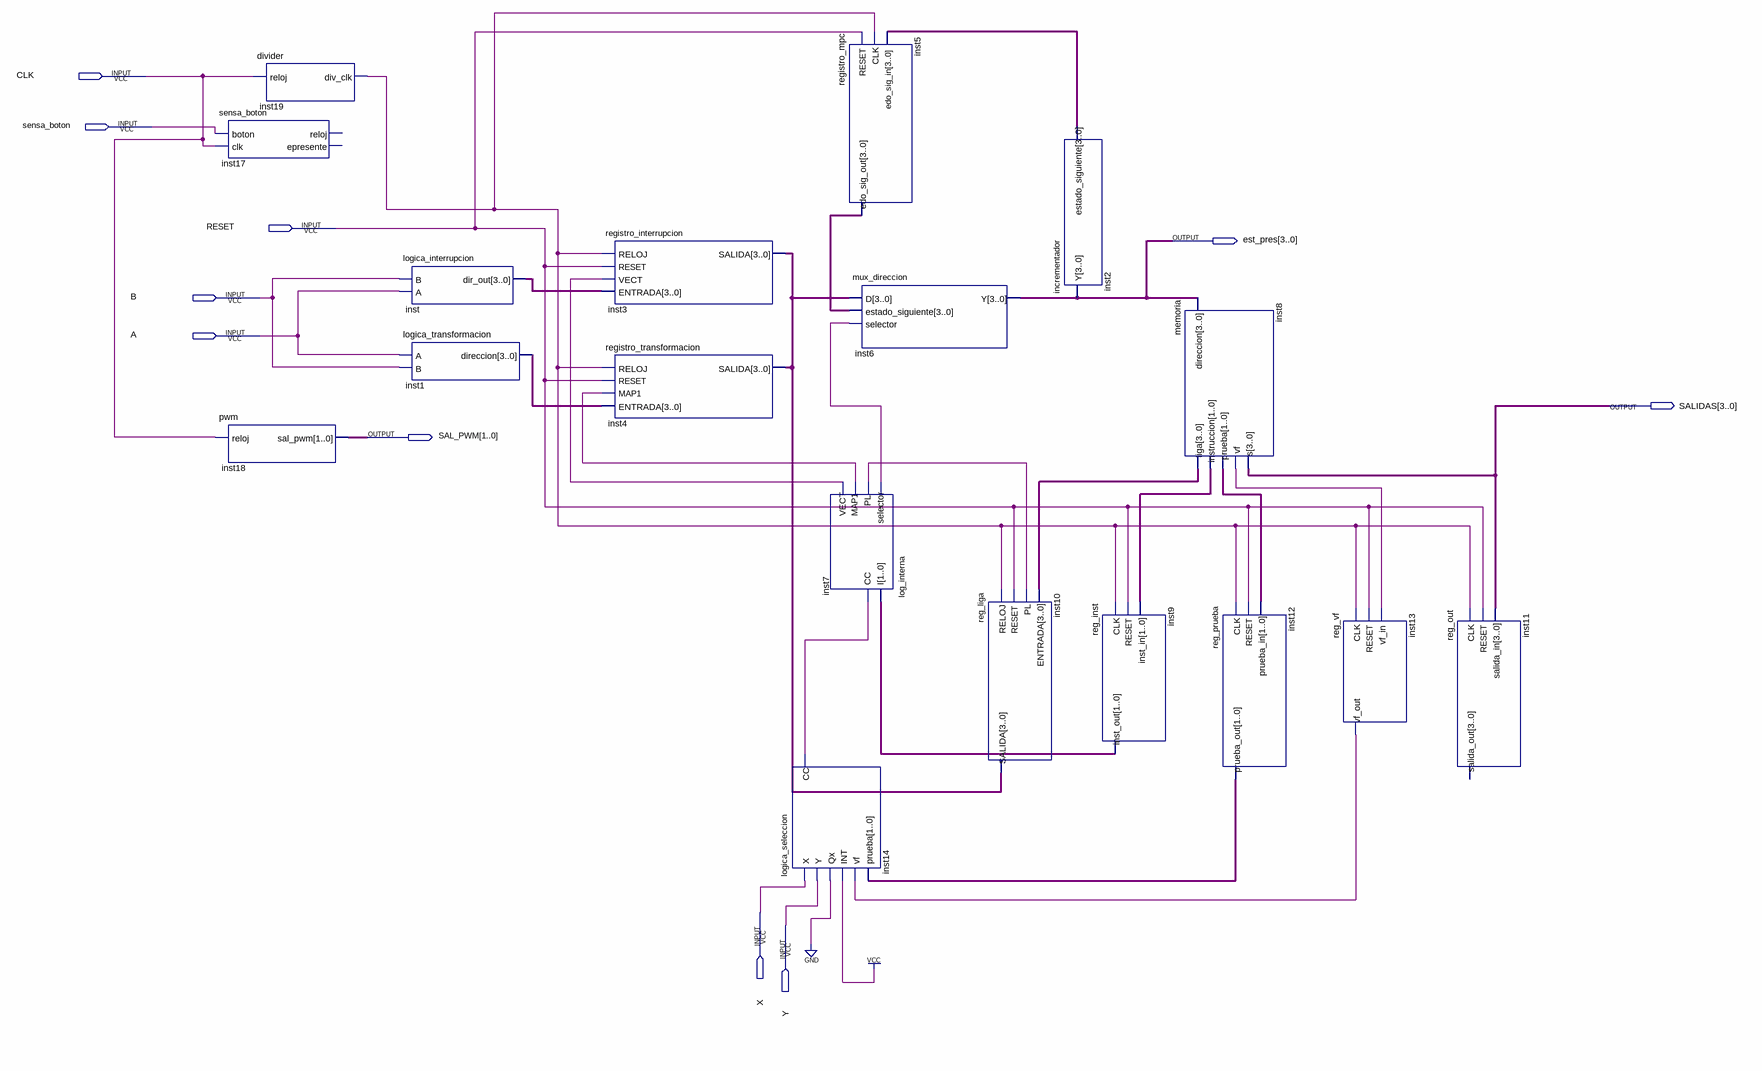
[diagram p0: schematic sheet]
// Quartus schematic secuen_completo.bdf as structural Verilog: 18 symbols, 10 pins
module secuen_completo (
  input  CLK,
  input  sensa_boton,
  input  RESET,
  input  B,
  input  A,
  input  X,
  input  Y,
  output [3:0] est_pres,
  output [3:0] SALIDAS,
  output [1:0] SAL_PWM
);

  wire inst7_map1, inst7_pl, inst7_selector, inst7_vect, inst8_vf, inst13_vf_out, inst14_cc, inst19_div_clk;
  wire [1:0] inst8_instruccion, inst8_prueba, inst9_inst_out, inst12_prueba_out;
  wire [3:0] inst1_direccion, inst2_estado_siguiente, inst3_salida, inst5_edo_sig_out, inst8_liga,
       inst_dir_out;

  sensa_boton inst17 (.boton(sensa_boton), .clk(CLK));  // open: reloj, epresente
  pwm inst18 (.reloj(CLK), .sal_pwm(SAL_PWM));
  divider inst19 (.reloj(CLK), .div_clk(inst19_div_clk));
  logica_interrupcion inst (.B(B), .A(A), .dir_out(inst_dir_out));
  logica_transformacion inst1 (.A(A), .B(B), .direccion(inst1_direccion));
  registro_interrupcion inst3 (
    .RELOJ(inst19_div_clk), .RESET(RESET), .VECT(inst7_vect), .ENTRADA(inst_dir_out), .SALIDA(inst3_salida));
  registro_transformacion inst4 (
    .RELOJ(inst19_div_clk), .RESET(RESET), .MAP1(inst7_map1), .ENTRADA(inst1_direccion), .SALIDA(inst3_salida));
  logica_seleccion inst14 (
    .X(X), .Y(Y), .Qx(1'b0), .INT(1'b1), .vf(inst13_vf_out), .prueba(inst12_prueba_out), .CC(inst14_cc));
  registro_mpc inst5 (
    .RESET(RESET), .CLK(inst19_div_clk), .edo_sig_in(inst2_estado_siguiente), .edo_sig_out(inst5_edo_sig_out));
  log_interna inst7 (
    .I(inst9_inst_out), .CC(inst14_cc), .selector(inst7_selector), .PL(inst7_pl), .MAP1(inst7_map1),
    .VECT(inst7_vect));
  mux_direccion inst6 (.D(inst3_salida), .estado_siguiente(inst5_edo_sig_out), .selector(inst7_selector), .Y(est_pres));
  reg_liga inst10 (.RELOJ(inst19_div_clk), .RESET(RESET), .PL(inst7_pl), .ENTRADA(inst8_liga), .SALIDA(inst3_salida));
  incrementador inst2 (.Y(est_pres), .estado_siguiente(inst2_estado_siguiente));
  reg_inst inst9 (.CLK(inst19_div_clk), .RESET(RESET), .inst_in(inst8_instruccion), .inst_out(inst9_inst_out));
  memoria inst8 (
    .direccion(est_pres), .liga(inst8_liga), .instruccion(inst8_instruccion), .prueba(inst8_prueba),
    .vf(inst8_vf), .s(SALIDAS));
  reg_prueba inst12 (.CLK(inst19_div_clk), .RESET(RESET), .prueba_in(inst8_prueba), .prueba_out(inst12_prueba_out));
  reg_vf inst13 (.CLK(inst19_div_clk), .RESET(RESET), .vf_in(inst8_vf), .vf_out(inst13_vf_out));
  reg_out inst11 (.CLK(inst19_div_clk), .RESET(RESET), .salida_in(SALIDAS));  // open: salida_out
endmodule
